# Altium project Current_Logging_Board_v2.PrjPcb
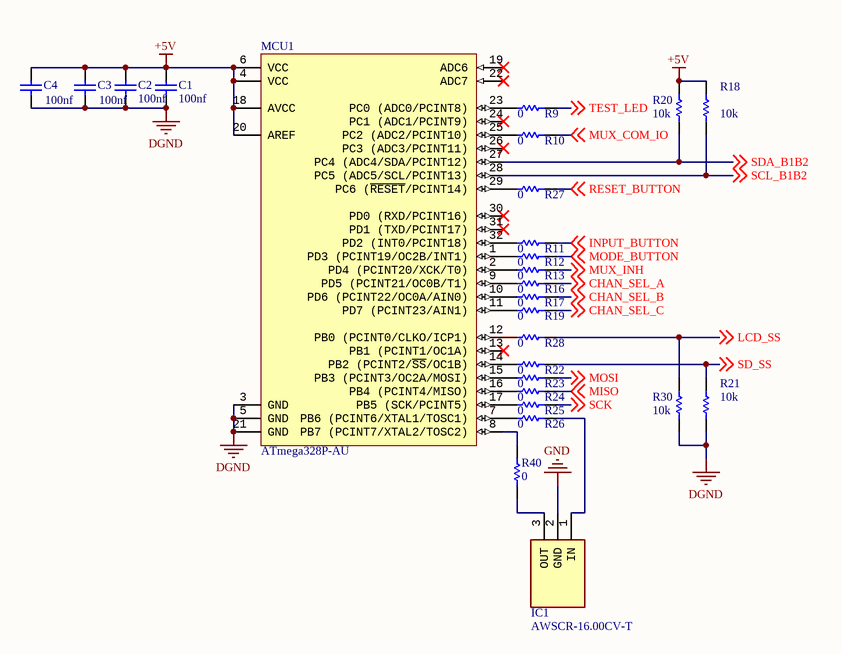
[diagram p0: mcu.SchDoc]
CAGE_CODE: ?????; CONTRACT_NUMBER: <CONTRACT NO>; DOC_NO_ASSY_DWG: <ASSY DWG NO>; DOC_NO_BOM: <BOM DOC NO>; DOC_NO_FAB_DWG: <FAB DWG NO>; DOC_NO_SCH_DWG: <SCH DWG NO>; PCB_2_DEC_TOL: +/-.01; PCB_3_DEC_TOL: +/-.010; PCB_ANG_TOL: +/-1/2; PCB_ASSEMBLY_NO: <PCB ASSY NO>; PCB_CHECKER: - -----; PCB_CHECKER_APP_DATE: --/--/----; PCB_DESIGNER: - -----; PCB_DESIGNER_APP_DATE: --/--/----; PCB_DWG_NO: <PCB DWG NO>; PCB_ENGINEER: - -----; PCB_ENGINEER_APP_DATE: --/--/----; PCB_PART_NUMBER: <PCB PN>; PCB_REV: A; SCH_REV: A
5 sheets, 65 parts. Net scope: global (net labels, ports and power ports of the same name join across sheets).
Board file: PCB1.PcbDoc
Sheets:
  title.SchDoc
  mcu.SchDoc
  headers.SchDoc
  shunts_and_amplifiers.SchDoc
  lcd.SchDoc

## Sheet title.SchDoc: Title
size B; Engineer: Jacob Faucett; Organization: CUAir; Address1: L3, 12a Rodborough Rd; Address2: Frenchs Forest; Address3: NSW; Address4: Australia 2086; Revision: 1; SheetNumber: 1; SheetTotal: 9; CompetitionYear: 2025; CPN: N/A; PROJECT: Current Logging and Validation Board

### Notes on the sheet
- Cornell University Unmanned Air Systems
- PROJECT:
- ID:
- ENGINEER
- REVISION
- Project
- Title
- Size:
- Date:
- B
- Number:
- Revision:
- File:

## Sheet mcu.SchDoc: MCU
size B; Engineer: Jacob Faucett; Organization: CUAir; Address1: L3, 12a Rodborough Rd; Address2: Frenchs Forest; Address3: NSW; Address4: Australia 2086; Revision: 1; SheetNumber: 2; SheetTotal: 9; CompetitionYear: 2025; CPN: N/A; PROJECT: Current Logging and Validation Board

### Parts
C1  100nf  [CAPC2013X95X45ML10T25]
C2  100nf  [CAPC2013X95X45NL10T25]
C3  100nf  [CAPC2013X95X45NL10T25]
C4  100nf  [CAPC2013X95X45NL10T25]
IC1  AWSCR-16.00CV-T  [AWSCR1600CVT]
MCU1  ATmega328P-AU  [32A_M]
R9  value 0  [0805]  (hidden comment: 0 (Empty Jumper))
R10  value 0  [0805]  (hidden comment: 0 (Empty Jumper))
R11  value 0  [0805]  (hidden comment: 0 (Empty Jumper))
R12  value 0  [0805]  (hidden comment: 0 (Empty Jumper))
R13  value 0  [0805]  (hidden comment: 0 (Empty Jumper))
R16  value 0  [0805]  (hidden comment: 0 (Empty Jumper))
R17  value 0  [0805]  (hidden comment: 0 (Empty Jumper))
R18  value 10k  [0805]  (hidden comment: 10000 (10k))
R19  value 0  [0805]  (hidden comment: 0 (Empty Jumper))
R20  value 10k  [0805]  (hidden comment: 10000 (10k))
R21  value 10k  [0805]  (hidden comment: 10000 (10k))
R22  value 0  [0805]  (hidden comment: 0 (Empty Jumper))
R23  value 0  [0805]  (hidden comment: 0 (Empty Jumper))
R24  value 0  [0805]  (hidden comment: 0 (Empty Jumper))
R25  value 0  [0805]  (hidden comment: 0 (Empty Jumper))
R26  value 0  [0805]  (hidden comment: 0 (Empty Jumper))
R27  value 0  [0805]  (hidden comment: 0 (Empty Jumper))
R28  value 0  [0805]  (hidden comment: 0 (Empty Jumper))
R30  value 10k  [0805]  (hidden comment: 10000 (10k))
R40  value 0  [0805]  (hidden comment: 0 (Empty Jumper))

### Nets
+5V: C1.2 C2.2 C3.2 C4.2 MCU1.4(VCC) MCU1.6(VCC) MCU1.18(AVCC) MCU1.20(AREF) R18.2 R20.2
DGND: C1.1 C2.1 C3.1 C4.1 MCU1.3(GND) MCU1.5(GND) MCU1.21(GND) R21.1 R30.1
GND: IC1.2(GND)
CHAN_SEL_A: R16.2 ; off-sheet CHAN_SEL_A
CHAN_SEL_B: R17.2 ; off-sheet CHAN_SEL_B
CHAN_SEL_C: R19.2 ; off-sheet CHAN_SEL_C
INPUT_BUTTON: R11.2 ; off-sheet INPUT_BUTTON
LCD_SS: R28.2 R30.2 ; off-sheet LCD_SS
MISO: R24.2 ; off-sheet MISO
MODE_BUTTON: R12.2 ; off-sheet MODE_BUTTON
MOSI: R23.2 ; off-sheet MOSI
MUX_COM_IO: R10.2 ; off-sheet MUX_COM_IO
MUX_INH: R13.2 ; off-sheet MUX_INH
RESET_BUTTON: R27.2 ; off-sheet RESET_BUTTON
SCK: R25.2 ; off-sheet SCK
SCL_B1B2: MCU1.28(PC5_(ADC5/SCL/PCINT13)) R18.1 ; off-sheet SCL_B1B2
SD_SS: R21.2 R22.2 ; off-sheet SD_SS
SDA_B1B2: MCU1.27(PC4_(ADC4/SDA/PCINT12)) R20.1 ; off-sheet SDA_B1B2
TEST_LED: R9.2 ; off-sheet TEST_LED
NetIC1_1: IC1.1(IN) R26.2
NetIC1_3: IC1.3(OUT) R40.1
NetMCU1_1: MCU1.1(PD3_(PCINT19/OC2B/INT1)) R12.1
NetMCU1_2: MCU1.2(PD4_(PCINT20/XCK/T0)) R13.1
NetMCU1_7: MCU1.7(PB6_(PCINT6/XTAL1/TOSC1)) R26.1
NetMCU1_8: MCU1.8(PB7_(PCINT7/XTAL2/TOSC2)) R40.2
NetMCU1_9: MCU1.9(PD5_(PCINT21/OC0B/T1)) R16.1
NetMCU1_10: MCU1.10(PD6_(PCINT22/OC0A/AIN0)) R17.1
NetMCU1_11: MCU1.11(PD7_(PCINT23/AIN1)) R19.1
NetMCU1_12: MCU1.12(PB0_(PCINT0/CLKO/ICP1)) R28.1
NetMCU1_14: MCU1.14(PB2_(PCINT2/~{SS}/OC1B)) R22.1
NetMCU1_15: MCU1.15(PB3_(PCINT3/OC2A/MOSI)) R23.1
NetMCU1_16: MCU1.16(PB4_(PCINT4/MISO)) R24.1
NetMCU1_17: MCU1.17(PB5_(SCK/PCINT5)) R25.1
NetMCU1_23: MCU1.23(PC0_(ADC0/PCINT8)) R9.1
NetMCU1_25: MCU1.25(PC2_(ADC2/PCINT10)) R10.1
NetMCU1_29: MCU1.29(PC6_(~{RESET}/PCINT14)) R27.1
NetMCU1_32: MCU1.32(PD2_(INT0/PCINT18)) R11.1

Not connected (* = marked no-connect by the designer): MCU1 13(PB1_(PCINT1/OC1A))* 19(ADC6)* 22(ADC7)* 24(PC1_(ADC1/PCINT9))* 26(PC3_(ADC3/PCINT11))* 30(PD0_(RXD/PCINT16))* 31(PD1_(TXD/PCINT17))*

### Notes on the sheet
- Project
- Title
- Size:
- Date:
- B
- Number:
- Revision:
- File:

### Library data of the parts
C1-C4 = CMP-1036-04169-2: Manufacturer: Murata; Part Number: GRM219R71H333KA01D
IC1 = CMP-031-00009-1: Industrial Grade Ceramic Resonator 16MHz; Manufacturer_Name: ABRACON; Arrow Price/Stock: https://www.arrow.com/en/products/awscr-16.00cv-t/abracon?region=nac; Manufacturer_Part_Number: AWSCR-16.00CV-T; Height: 1mm; Design Item ID: AWSCR-16.00CV-T; MPN: AWSCR-16.00CV-T; Source: SamacSys.SchLib; Arrow Part Number: AWSCR-16.00CV-T; Datasheet Link: https://abracon.com/Resonators/AWSCR_CV.pdf
MCU1 = CMP-0095-00269-2: 8-bit AVR Microcontroller, 32KB Flash, 1KB EEPROM, 2KB SRAM, 32-pin TQFP, Industrial Grade (-40°C to 85°C); PackageDescription: 32-Lead, 7x7x1.0 mm Body, 0.8mm Lead Pitch, Thin Profile Plastic Quad Flat Package (TQFP); DatasheetVersion: revD, May-2011; RevisionNote: DatasheetVersion & PackageVersion updated. URLs added.; ComponentLink1URL: http://www.atmel.com/; ComponentLink2Description: ATmega48A/48PA/88A/88PA/168A/168PA/328/328P Datasheet; Code_JEDEC: MS-026-ABA; ComponentLink1Description: Manufacturer URL; PackageReference: 32A; ComponentLink3Description: ATmega48A/48PA/88A/88PA/168A/168PA/328/328P Summary; ComponentLink2URL: http://www.atmel.com/dyn/resources/prod_documents/doc8271.pdf; PackageVersion: revC, Oct-2010; ComponentLink3URL: http://www.atmel.com/dyn/resources/prod_documents/8271S.pdf
R9-R13 R16 R17 R19 R22-R28 R40 = CMP-009-00239-1: RES Thick Film, 0Ω, 0.125W, 150V, 0805; Design Item ID: 0 (Empty Jumper); DNI: DNI; Source: JLCPCB Resistor Schematic Lib.SchLib; ComponentLink1Description: Source; DNP: DNP; ComponentLink1URL: https://www.mouser.com/ProductDetail/Panasonic/ERJ-6GEY0R00V?qs=tQNqqtTOejLLHbaWAzeH1w%3D%3D
R18 R20 R21 R30 = CMP-009-00203-1: RES Thick Film, 10kΩ, 0.125W, 150V, 0805; Manufacturer: UNI-ROYAL; MPN: 0805W8F1002T5E; Power Rating: 125mW; ComponentLink1URL: https://jlcpcb.com/partdetail/18102-0805W8F1002T5E/C17414; ComponentLink1Description: Source; Design Item ID: 10000 (10k); JLCPCB Basic Part: TRUE; Voltage Rating: 150V; Source: JLCPCB Resistor Schematic Lib.SchLib; JLCPCB Part #: C17414

## Sheet headers.SchDoc: Headers
size B; Engineer: Jacob Faucett; Organization: CUAir; Address1: L3, 12a Rodborough Rd; Address2: Frenchs Forest; Address3: NSW; Address4: Australia 2086; Revision: 1; SheetNumber: 3; SheetTotal: 9; CompetitionYear: 2025; CPN: N/A; PROJECT: Current Logging and Validation Board
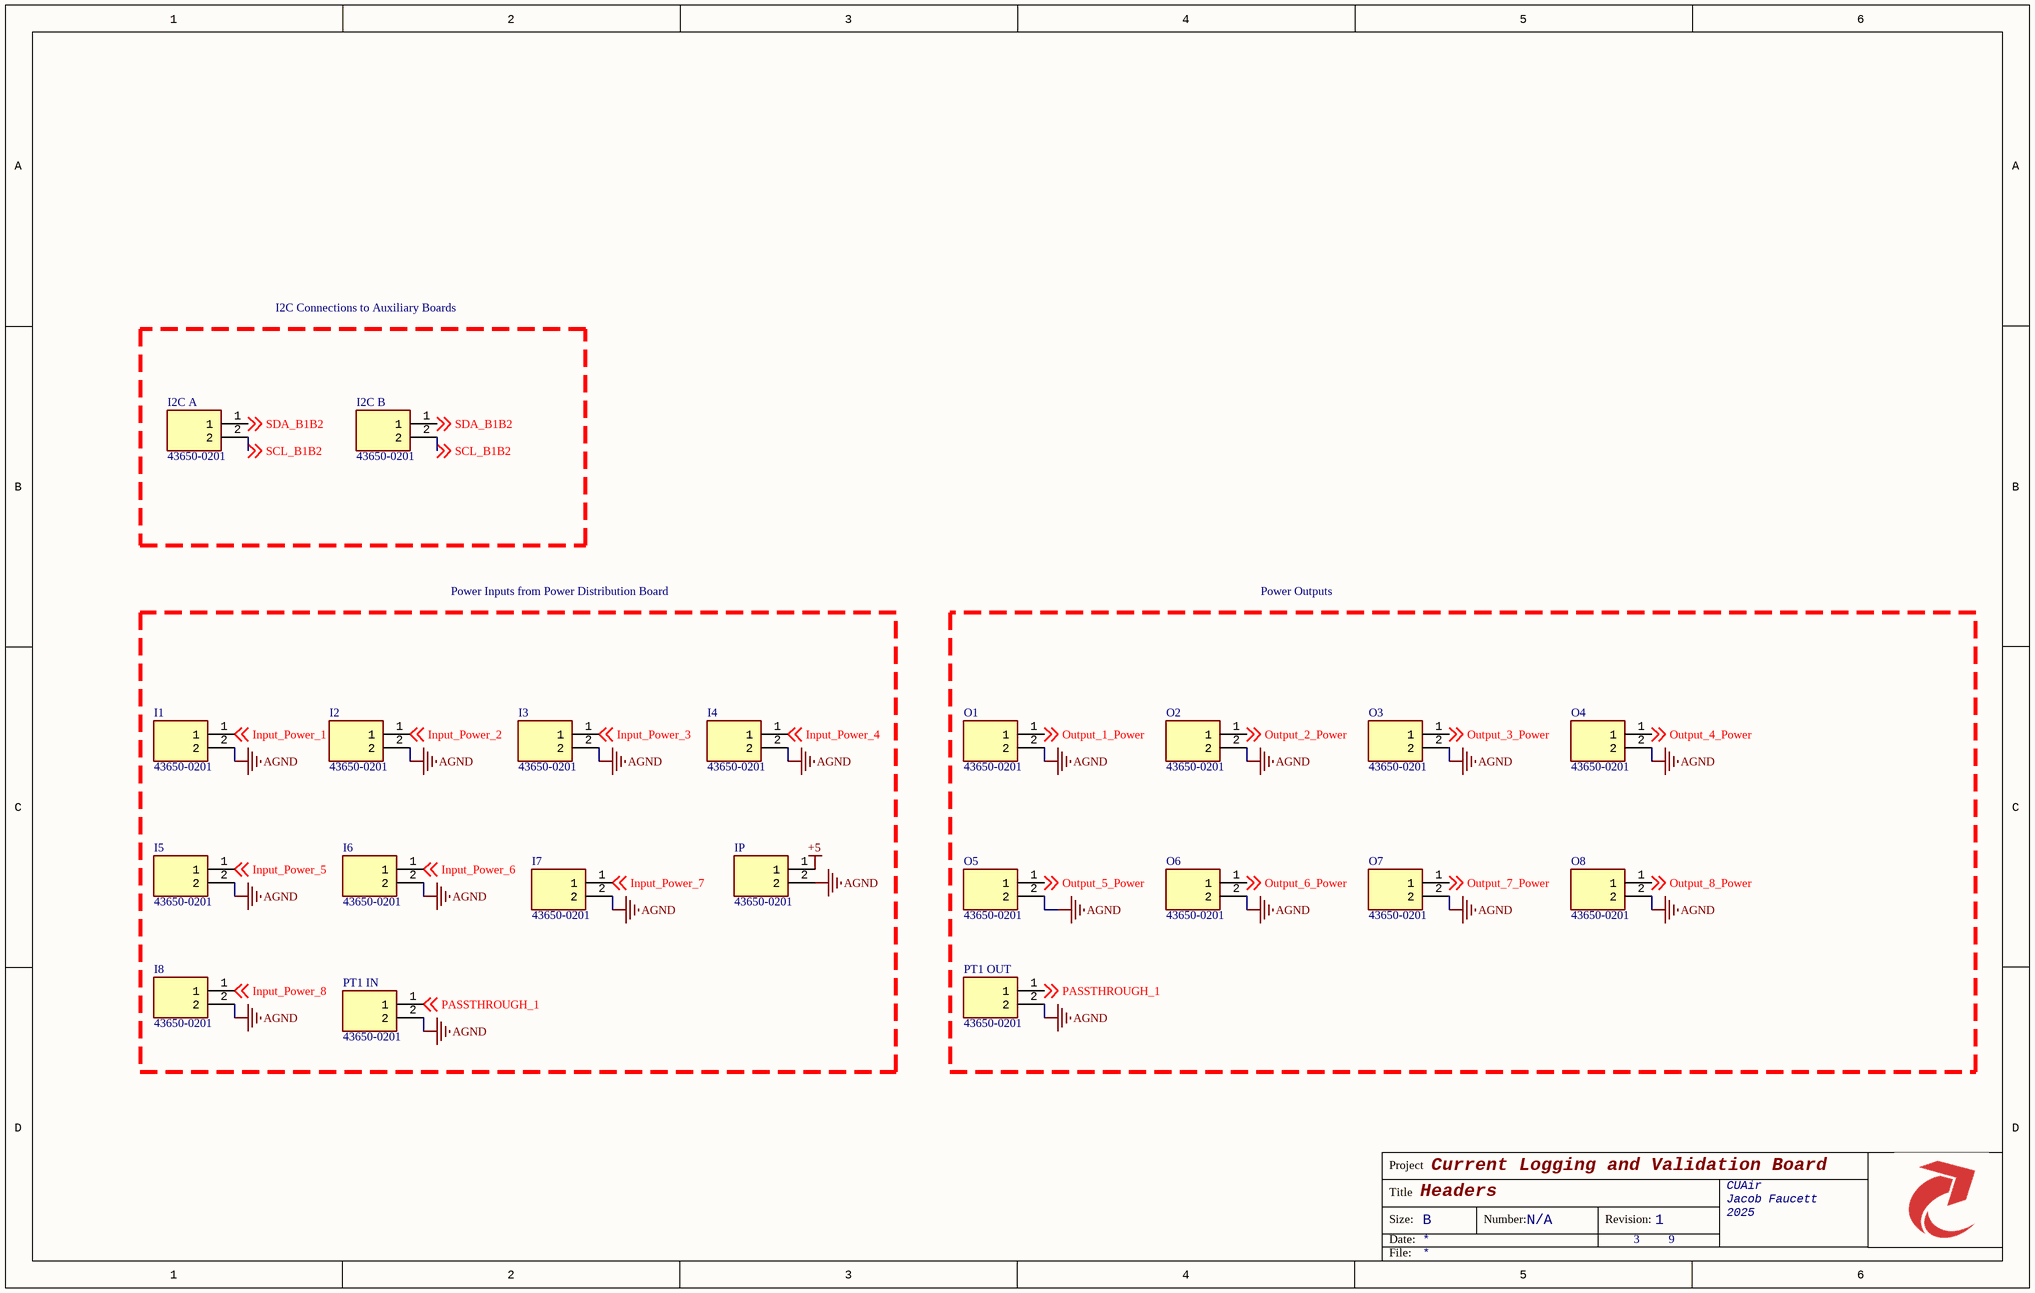
[diagram p1: headers.SchDoc]

### Parts
I1  43650-0201  [43650-02(00,01,02)]
I2  43650-0201  [43650-02(00,01,02)]
I2C_A  43650-0201  [43650-02(00,01,02)]
I2C_B  43650-0201  [43650-02(00,01,02)]
I3  43650-0201  [43650-02(00,01,02)]
I4  43650-0201  [43650-02(00,01,02)]
I5  43650-0201  [43650-02(00,01,02)]
I6  43650-0201  [43650-02(00,01,02)]
I7  43650-0201  [43650-02(00,01,02)]
I8  43650-0201  [43650-02(00,01,02)]
IP  43650-0201  [43650-02(00,01,02)]
O1  43650-0201  [43650-02(00,01,02)]
O2  43650-0201  [43650-02(00,01,02)]
O3  43650-0201  [43650-02(00,01,02)]
O4  43650-0201  [43650-02(00,01,02)]
O5  43650-0201  [43650-02(00,01,02)]
O6  43650-0201  [43650-02(00,01,02)]
O7  43650-0201  [43650-02(00,01,02)]
O8  43650-0201  [43650-02(00,01,02)]
PT1_IN  43650-0201  [43650-02(00,01,02)]
PT1_OUT  43650-0201  [43650-02(00,01,02)]

### Blocks framed on the sheet
I2C Connections to Auxiliary Boards: I2C_A I2C_B
Power Inputs from Power Distribution Board: I1-I8 IP PT1_IN
Power Outputs: O1-O8 PT1_OUT

### Nets
+5: IP.1
AGND: I1.2 I2.2 I3.2 I4.2 I5.2 I6.2 I7.2 I8.2 IP.2 O1.2 O2.2 O3.2 O4.2 O5.2 O6.2 O7.2 O8.2 PT1_IN.2 PT1_OUT.2
Input_Power_1: I1.1 ; off-sheet Input_Power_1
Input_Power_2: I2.1 ; off-sheet Input_Power_2
Input_Power_3: I3.1 ; off-sheet Input_Power_3
Input_Power_4: I4.1 ; off-sheet Input_Power_4
Input_Power_5: I5.1 ; off-sheet Input_Power_5
Input_Power_6: I6.1 ; off-sheet Input_Power_6
Input_Power_7: I7.1 ; off-sheet Input_Power_7
Input_Power_8: I8.1 ; off-sheet Input_Power_8
Output_1_Power: O1.1 ; off-sheet Output_1_Power
Output_2_Power: O2.1 ; off-sheet Output_2_Power
Output_3_Power: O3.1 ; off-sheet Output_3_Power
Output_4_Power: O4.1 ; off-sheet Output_4_Power
Output_5_Power: O5.1 ; off-sheet Output_5_Power
Output_6_Power: O6.1 ; off-sheet Output_6_Power
Output_7_Power: O7.1 ; off-sheet Output_7_Power
Output_8_Power: O8.1 ; off-sheet Output_8_Power
PASSTHROUGH_1: PT1_IN.1 PT1_OUT.1 ; off-sheet PASSTHROUGH_1
SCL_B1B2: I2C_A.2 I2C_B.2 ; off-sheet SCL_B1B2
SDA_B1B2: I2C_A.1 I2C_B.1 ; off-sheet SDA_B1B2

### Notes on the sheet
- Project
- Title
- Size:
- Date:
- B
- Number:
- Revision:
- File:

### Library data of the parts
I1 I2 I2C_A I2C_B I3-I8 IP O1-O8 PT1_IN PT1_OUT = CMP-002-00072-2: Connector; Manufacturer_Name: Molex; Design Item ID: 43650-0201; Source: 1x2 Right Angle Molex Microfit.SchLib; Mouser Price/Stock: https://www.mouser.co.uk/ProductDetail/Molex/43650-0201?qs=HlEFOAM0q6XDqOKWr68Eiw%3D%3D; Height: 5.57mm; Manufacturer_Part_Number: 43650-0201; Mouser Part Number: 538-43650-0201; Datasheet Link: https://www.molex.com/pdm_docs/sd/436500200_sd.pdf

## Sheet shunts_and_amplifiers.SchDoc: Shunts and Amplifiers
size B; Engineer: Jacob Faucett; Organization: CUAir; Address1: L3, 12a Rodborough Rd; Address2: Frenchs Forest; Address3: NSW; Address4: Australia 2086; Revision: 1; SheetNumber: 6; SheetTotal: 9; CompetitionYear: 2025; CPN: N/A; PROJECT: Current Logging and Validation Board
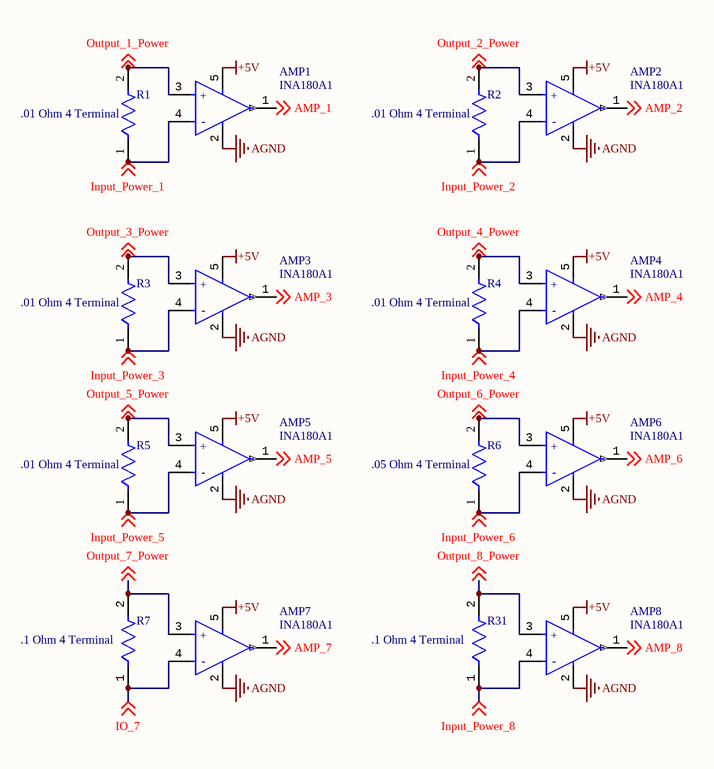
[diagram p2: shunts_and_amplifiers.SchDoc]

### Parts
AMP1  INA180A1  [FP-DBV0005A-IPC_A]
AMP2  INA180A1  [FP-DBV0005A-IPC_A]
AMP3  INA180A1  [FP-DBV0005A-IPC_A]
AMP4  INA180A1  [FP-DBV0005A-IPC_A]
AMP5  INA180A1  [FP-DBV0005A-IPC_A]
AMP6  INA180A1  [FP-DBV0005A-IPC_A]
AMP7  INA180A1  [FP-DBV0005A-IPC_A]
AMP8  INA180A1  [FP-DBV0005A-IPC_A]
R1  .01 Ohm 4 Terminal  [FP-WSR3-MFG]
R2  .01 Ohm 4 Terminal  [FP-WSR3-MFG]
R3  .01 Ohm 4 Terminal  [FP-WSR3-MFG]
R4  .01 Ohm 4 Terminal  [FP-WSR3-MFG]
R5  .01 Ohm 4 Terminal  [FP-WSR3-MFG]
R6  .05 Ohm 4 Terminal  [FP-WSR3-MFG]
R7  .1 Ohm 4 Terminal  [FP-WSR-MFG]
R31  .1 Ohm 4 Terminal  [FP-WSR-MFG]

### Nets
+5V: AMP1.5(VS) AMP2.5(VS) AMP3.5(VS) AMP4.5(VS) AMP5.5(VS) AMP6.5(VS) AMP7.5(VS) AMP8.5(VS)
AGND: AMP1.2(GND) AMP2.2(GND) AMP3.2(GND) AMP4.2(GND) AMP5.2(GND) AMP6.2(GND) AMP7.2(GND) AMP8.2(GND)
AMP_1: AMP1.1(OUT) ; off-sheet AMP_1
AMP_2: AMP2.1(OUT) ; off-sheet AMP_2
AMP_3: AMP3.1(OUT) ; off-sheet AMP_3
AMP_4: AMP4.1(OUT) ; off-sheet AMP_4
AMP_5: AMP5.1(OUT) ; off-sheet AMP_5
AMP_6: AMP6.1(OUT) ; off-sheet AMP_6
AMP_7: AMP7.1(OUT) ; off-sheet AMP_7
AMP_8: AMP8.1(OUT) ; off-sheet AMP_8
Input_Power_1: AMP1.4(IN-) R1.1 ; off-sheet Input_Power_1
Input_Power_2: AMP2.4(IN-) R2.1 ; off-sheet Input_Power_2
Input_Power_3: AMP3.4(IN-) R3.1 ; off-sheet Input_Power_3
Input_Power_4: AMP4.4(IN-) R4.1 ; off-sheet Input_Power_4
Input_Power_5: AMP5.4(IN-) R5.1 ; off-sheet Input_Power_5
Input_Power_6: AMP6.4(IN-) R6.1 ; off-sheet Input_Power_6
Input_Power_8: AMP8.4(IN-) R31.1 ; off-sheet Input_Power_8
IO_7: AMP7.4(IN-) R7.1 ; off-sheet IO_7
Output_1_Power: AMP1.3(IN+) R1.2 ; off-sheet Output_1_Power
Output_2_Power: AMP2.3(IN+) R2.2 ; off-sheet Output_2_Power
Output_3_Power: AMP3.3(IN+) R3.2 ; off-sheet Output_3_Power
Output_4_Power: AMP4.3(IN+) R4.2 ; off-sheet Output_4_Power
Output_5_Power: AMP5.3(IN+) R5.2 ; off-sheet Output_5_Power
Output_6_Power: AMP6.3(IN+) R6.2 ; off-sheet Output_6_Power
Output_7_Power: AMP7.3(IN+) R7.2 ; off-sheet Output_7_Power
Output_8_Power: AMP8.3(IN+) R31.2 ; off-sheet Output_8_Power

### Notes on the sheet
- Project
- Title
- Size:
- Date:
- B
- Number:
- Revision:
- File:
- (in symbol CMP-04895-000140-1) +; -

### Library data of the parts
AMP1-AMP8 = CMP-04895-000140-1: IC CURR SENSE 1 CIRCUIT SOT23-5; Input Bias Current: 100nA; Input Offset Voltage (Vos): 100uV; Number of Circuits: 1; Slew Rate: 2V/µs; -3db Bandwidth: 350kHz; Operating Supply Current: 260uA; Case/Package: SOT-23-5; Min Operating Temperature: -40°C; Mount: Surface Mount; Packaging: Tape and Reel; Max Operating Temperature: 125°C
R1-R6 = CMP-00030-39814339-1: WSR3R0500FEA Res Metal Strip 4527 0.05 Ohm 1% 3W ±75ppm/°C Molded SMD SMD Embossed Plastic T/R; Voltage Rating: 380mV; Resistance: 50mΩ; Mount: Surface Mount; Case/Package: 4527; Height: 2.41mm; Width: 6.98mm; Depth: 6.98mm; Lead Free: Lead Free; Schedule B: 8533210045, 8533210045; Max Operating Temperature: 275°C; Power Rating: 3W; Composition: Metal Strip; Contact Plating: Silver, Tin; Voltage Rating (DC): 380mV; Radiation Hardening: No; Termination: SMD/SMT; Tolerance: 1%; Length: 11.56mm; Min Operating Temperature: -65°C; Case Code (Imperial): 4527; REACH SVHC: No SVHC; Temperature Coefficient: 75ppm/°C; NexarPartId: 39814339; Packaging: Cut Tape; Military Standard: Not; RoHS: Compliant
R7 R31 = CMP-02407-000027-1: RES 0.1 OHM 1% 3W 4527 / WSR3R1000FEK; Manufacturer: Vishay; Value: 100mΩ; Temperature Coefficient: 75ppm/°C; Automotive Grade: Grade 0; Digikey Description: RES 0.1 OHM 1% 3W 4527; Temperature Range High: +275°C; ComponentLink2URL: http://www.vishay.com/docs/30101/wsr.pdf; Manufacturer Part Number: WSR3R1000FEK; RoHS: TRUE; Device Class L1: Passive Components; Automotive: Yes; Temperature Range Low: -65°C; Tolerance: 1%; Device Class L3: Chip SMD Resistors; Series: WSR; Temperature: -65°C to +275°C; Resistance: 100mΩ; Device Class L2: Resistors; Octopart: https://octopart.com/wsr3r1000fek-vishay-39709091; Package: WSR; Mouser Description: Res Metal Strip 4527 0.1 Ohm 1% 3W ±75ppm/C Sulfur Resistant Molded J-Lead SMD Automotive Bulk; Power Rating: 3W; ComponentLink2Description: Datasheet; Composition: Metal Strip; Category: Res; Lead Free: Yes; Height: 2.537mm

## Sheet lcd.SchDoc: LCD
size B; Engineer: Jacob Faucett; Organization: CUAir; Address1: L3, 12a Rodborough Rd; Address2: Frenchs Forest; Address3: NSW; Address4: Australia 2086; Revision: 1; SheetNumber: 7; SheetTotal: 9; CompetitionYear: 2025; CPN: N/A; PROJECT: Current Logging and Validation Board
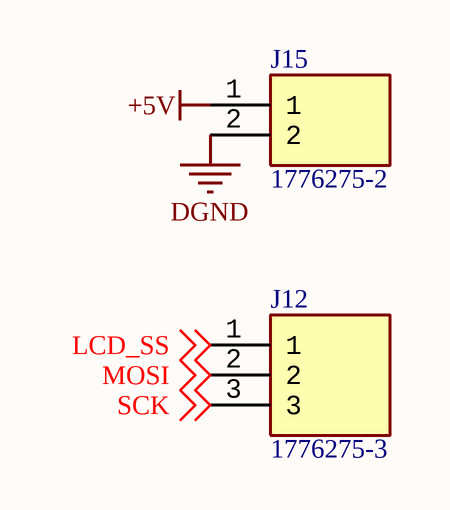
[diagram p3: lcd.SchDoc]

### Parts
J12  1776275-3  [17762753]
J15  1776275-2  [17762752]

### Nets
+5V: J15.1
DGND: J15.2
LCD_SS: J12.1 ; off-sheet LCD_SS
MOSI: J12.2 ; off-sheet MOSI
SCK: J12.3 ; off-sheet SCK

### Notes on the sheet
- Project
- Title
- Size:
- Date:
- B
- Number:
- Revision:
- File:

### Library data of the parts
J12 = 1776275-3: Connector; Manufacturer_Name: TE Connectivity; Datasheet Link: https://www.te.com/commerce/DocumentDelivery/DDEController?Action=srchrtrv&DocNm=1-1773458-1_EURO_STYLE_QRG&DocType=Data%20Sheet&DocLang=English&PartCntxt=1776275-3&DocFormat=pdf; Height: 8.3mm; Manufacturer_Part_Number: 1776275-3; Mouser Part Number: 571-1776275-3; Mouser Price/Stock: https://www.mouser.co.uk/ProductDetail/TE-Connectivity/1776275-3?qs=vnwGVgFuQiaG2mifqnUIBA%3D%3D; Arrow Part Number: 1776275-3; Arrow Price/Stock: https://www.arrow.com/en/products/1776275-3/te-connectivity?region=nac
J15 = 1776275-2: Connector; Manufacturer_Name: TE Connectivity; Datasheet Link: https://www.te.com/commerce/DocumentDelivery/DDEController?Action=srchrtrv&DocNm=1-1773458-1_EURO_STYLE_QRG&DocType=Data%20Sheet&DocLang=English&PartCntxt=1776275-2&DocFormat=pdf; Height: 8.6mm; Manufacturer_Part_Number: 1776275-2; Mouser Part Number: 571-1776275-2; Mouser Price/Stock: https://www.mouser.co.uk/ProductDetail/TE-Connectivity/1776275-2?qs=vnwGVgFuQiZz9SD%252Bziemgw%3D%3D; Arrow Part Number: 1776275-2; Arrow Price/Stock: https://www.arrow.com/en/products/1776275-2/te-connectivity?region=nac

## Nets that join several sheets
+5V: mcu (10 pins), shunts_and_amplifiers (8 pins), lcd (J15.1)
AGND: headers (19 pins), shunts_and_amplifiers (8 pins)
DGND: mcu (9 pins), lcd (J15.2)
Input_Power_1: headers (I1.1), shunts_and_amplifiers (AMP1.4 R1.1)
Input_Power_2: headers (I2.1), shunts_and_amplifiers (AMP2.4 R2.1)
Input_Power_3: headers (I3.1), shunts_and_amplifiers (AMP3.4 R3.1)
Input_Power_4: headers (I4.1), shunts_and_amplifiers (AMP4.4 R4.1)
Input_Power_5: headers (I5.1), shunts_and_amplifiers (AMP5.4 R5.1)
Input_Power_6: headers (I6.1), shunts_and_amplifiers (AMP6.4 R6.1)
Input_Power_8: headers (I8.1), shunts_and_amplifiers (AMP8.4 R31.1)
LCD_SS: mcu (R28.2 R30.2), lcd (J12.1)
MOSI: mcu (R23.2), lcd (J12.2)
Output_1_Power: headers (O1.1), shunts_and_amplifiers (AMP1.3 R1.2)
Output_2_Power: headers (O2.1), shunts_and_amplifiers (AMP2.3 R2.2)
Output_3_Power: headers (O3.1), shunts_and_amplifiers (AMP3.3 R3.2)
Output_4_Power: headers (O4.1), shunts_and_amplifiers (AMP4.3 R4.2)
Output_5_Power: headers (O5.1), shunts_and_amplifiers (AMP5.3 R5.2)
Output_6_Power: headers (O6.1), shunts_and_amplifiers (AMP6.3 R6.2)
Output_7_Power: headers (O7.1), shunts_and_amplifiers (AMP7.3 R7.2)
Output_8_Power: headers (O8.1), shunts_and_amplifiers (AMP8.3 R31.2)
SCK: mcu (R25.2), lcd (J12.3)
SCL_B1B2: mcu (MCU1.28 R18.1), headers (I2C_A.2 I2C_B.2)
SDA_B1B2: mcu (MCU1.27 R20.1), headers (I2C_A.1 I2C_B.1)

## Assembly variants
DNP: not fitted R1 R2 R3 R4 R5 R6 R7